# Altium project Liquid Boost.PrjPcb
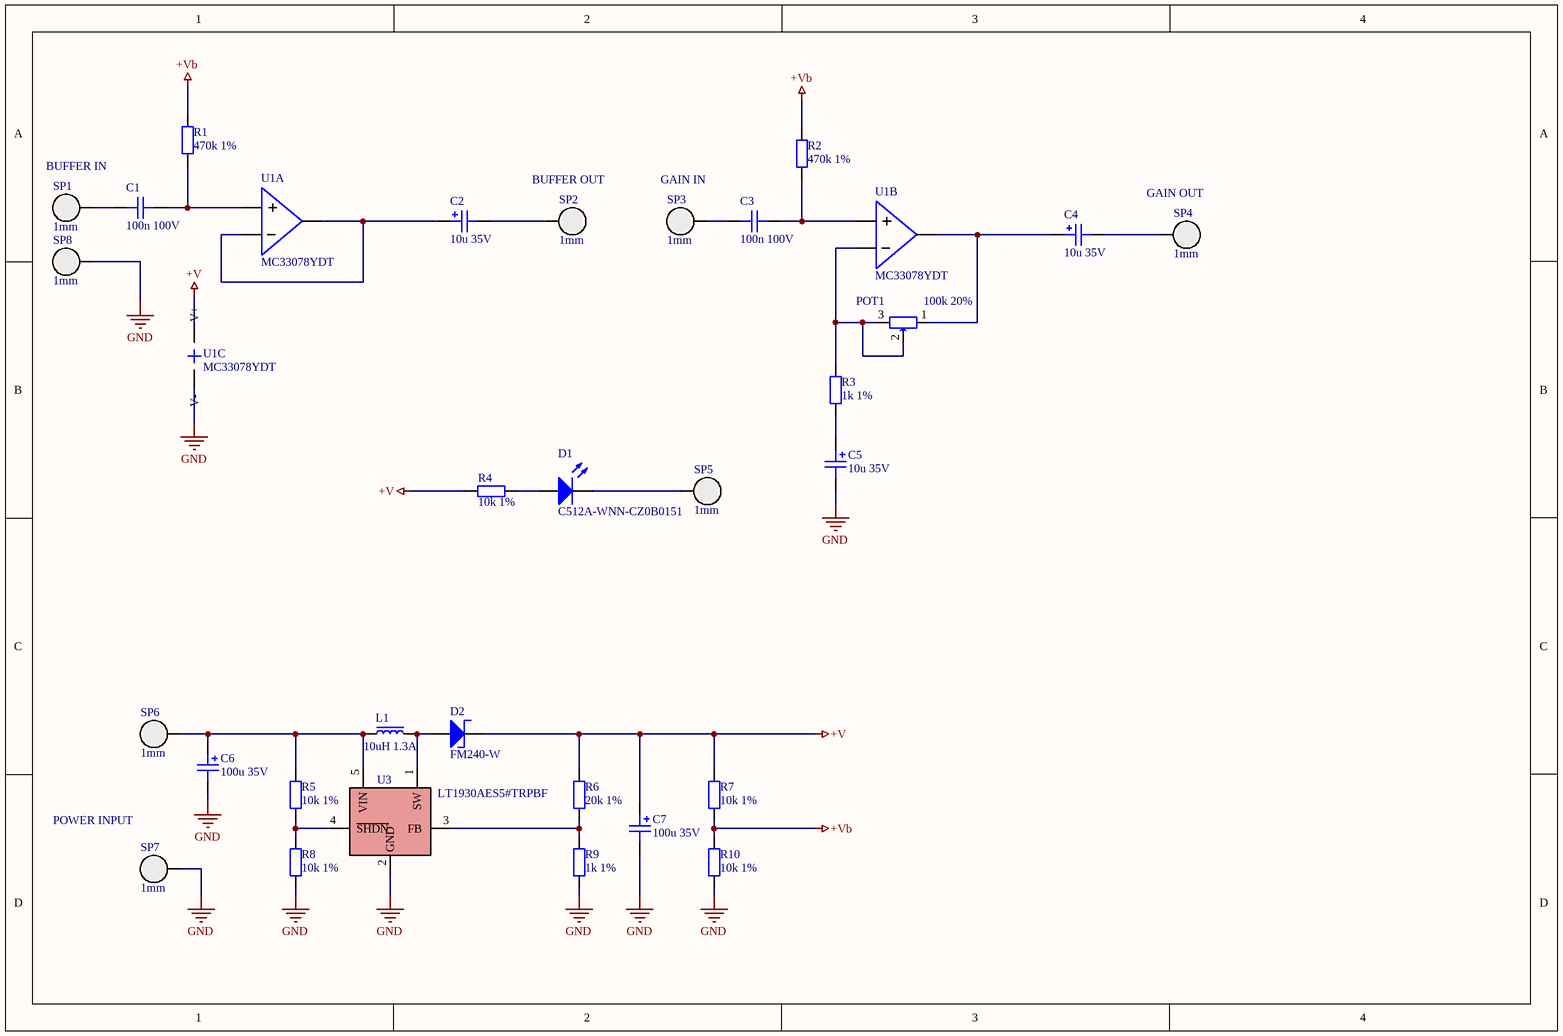
[diagram p0: Liquid Boost.SchDoc]
Series: Liquid; Effect: Booster; Date: 13.10.2021; SCH Designer: Mateusz Kowalczyk; PCB Designer: Mateusz Kowalczyk
1 sheet, 31 parts. Net scope: global (net labels, ports and power ports of the same name join across sheets).
Board file: Liquid Boost.PcbDoc

## Sheet Liquid Boost.SchDoc
size A4

### Parts
C1  100n 100V  [R82EC3100AA70K]
C2  10u 35V  [860010573007]
C3  100n 100V  [R82EC3100AA70K]
C4  10u 35V  [860010573007]
C5  10u 35V  [860010573007]
C6  100u 35V  [860010573007]
C7  100u 35V  [860010573007]
D1  C512A-WNN-CZ0B0151  [C512A-WNN-CZ0B0151]
D2  FM240-W  [FM240-W]
L1  10uH 1.3A  [VLS252012HBX-100M-1]
POT1  100k 20%  [PTV09A]
R1  470k 1%  [Resistor 0603]
R2  470k 1%  [Resistor 0603]
R3  1k 1%  [Resistor 0603]
R4  10k 1%  [Resistor 0603]
R5  10k 1%  [Resistor 0603]
R6  20k 1%  [Resistor 0603]
R7  10k 1%  [Resistor 0603]
R8  10k 1%  [Resistor 0603]
R9  1k 1%  [Resistor 0603]
R10  10k 1%  [Resistor 0603]
SP1  1mm  [SOLDER PAD 1mm]
SP2  1mm  [SOLDER PAD 1mm]
SP3  1mm  [SOLDER PAD 1mm]
SP4  1mm  [SOLDER PAD 1mm]
SP5  1mm  [SOLDER PAD 1mm]
SP6  1mm  [SOLDER PAD 1mm]
SP7  1mm  [SOLDER PAD 1mm]
SP8  1mm  [SOLDER PAD 1mm]
U1  MC33078YDT  [MC33078YDT]  (parts A,B,C of 3)
U3  LT1930AES5#TRPBF  [LT1930AES5#TRPBF]

### Nets
+V: C7.1 D2.2 R4.2 R6.2 R7.2 U1.8(V+)
+Vb: R1.2 R2.2 R7.1 R10.2
GND: C5.2 C6.2 C7.2 R8.1 R9.1 R10.1 SP7.1 SP8.1 U1.4(V-) U3.2(GND)
NetC1_1: C1.1 SP1.1
NetC1_2: C1.2 R1.1 U1.3(IN+)
NetC2_1: C2.1 U1.1(OUT) U1.2(IN-)
NetC2_2: C2.2 SP2.1
NetC3_1: C3.1 SP3.1
NetC3_2: C3.2 R2.1 U1.5(IN+)
NetC4_1: C4.1 POT1.1 U1.7(OUT)
NetC4_2: C4.2 SP4.1
NetC5_1: C5.1 R3.1
NetC6_1: C6.1 L1.1 R5.2 SP6.1 U3.5(VIN)
NetD1_1: D1.1 R4.1
NetD1_2: D1.2 SP5.1
NetD2_1: D2.1 L1.2 U3.1(SW)
NetPOT1_2: POT1.2 POT1.3 R3.2 U1.6(IN-)
NetR5_1: R5.1 R8.2 U3.4(~{SHDN})
NetR6_1: R6.1 R9.2 U3.3(FB)

### Notes on the sheet
- BUFFER IN
- (near SP2) BUFFER OUT
- GAIN IN
- (near SP4) GAIN OUT
- (near SP7) POWER INPUT

### Library data of the parts
C1 C3 = Capacitor 100n 10% 100V R82EC3100AA70K: Film Capacitors 100V 0.1uF 10% LS=5mm AEC-Q200; ComponentLink1Description: Datasheet; ComponentLink1URL: https://pl.mouser.com/datasheet/2/212/1/KEM_F3101_R82-1103738.pdf; Manufacturer Part Number: R82EC3100AA70K
C2 C4 C5 = Capacitor 10u 35V 20% 5mm THT RFS-35V100ME3#5: Aluminum Electrolytic Capacitors - Radial Leaded 10uF 35V 20% Audio SILMIC II; ComponentLink1Description: Datasheet; ComponentLink1URL: https://pl.mouser.com/datasheet/2/129/rfs_e-606.pdf; Manufacturer Part Number: RFS-35V100ME3#5
C6 C7 = Capacitor 100u 35V 20% 6.3mm THT 860010573007: Aluminum Electrolytic Capacitors - Radial Leaded WCAP-ATG8 100uF 35V 20% Radial; ComponentLink1Description: Datasheet; ComponentLink1URL: https://pl.mouser.com/datasheet/2/445/860010573007-1725319.pdf; Manufacturer Part Number: 860010573007
D1 = Diode LED 5mm White THT C512A-WNN-CZ0B0151: Standard LEDs - Through Hole Cool White 4600K 8200-23500mcd; ComponentLink1Description: Datasheet; ComponentLink1URL: https://pl.mouser.com/datasheet/2/723/C512A_WNS_WNN_942-2257872.pdf; Manufacturer Part Number: C512A-WNN-CZ0B0151
D2 = Diode Schottky 2A 40V FM240-W: Schottky Diodes & Rectifiers 2A 40V Schottky; ComponentLink1Description: Datasheet; ComponentLink1URL: https://pl.mouser.com/datasheet/2/345/fm220-fm2200-2949.pdf; Manufacturer Part Number: FM240-W
L1 = Inductor 10uH 1.3A 540mOhms VLS252012HBX-100M-1: Fixed Inductors 10uH 1.3A 540mOhms Power Circuits; ComponentLink1Description: Datasheet; ComponentLink1URL: https://product.tdk.com/system/files/dam/doc/product/inductor/inductor/smd/catalog/inductor_commercial_power_vls252012hbx-1_en.pdf; Manufacturer Part Number: VLS252012HBX-100M-1
POT1 = Potentiometer 100k 20% PTV09A-4015F-B104: Potentiometers 100K 20% 9MM CARBON POT /; ComponentLink1Description: Datasheet; ComponentLink1URL: https://pl.mouser.com/datasheet/2/54/ptv09-777818.pdf; Manufacturer Part Number: PTV09A-4015F-B104
R1 R2 = Resistor 470k 1% RT0603FRE07470KL: Thin Film Resistors - SMD 1/10W 470K ohm 1% 50ppm; ComponentLink1Description: Datasheet; ComponentLink1URL: https://pl.mouser.com/datasheet/2/447/PYu_RT_1_to_0_01_RoHS_L_11-1669912.pdf; Manufacturer Part Number: RT0603FRE07470KL
R3 R9 = Resistor 1k 1% RT0603FRE071KL: Thin Film Resistors - SMD 1K ohm 1% 1/10W; ComponentLink1Description: Datasheet; ComponentLink1URL: https://pl.mouser.com/datasheet/2/447/PYu_RT_1_to_0_01_RoHS_L_11-1669912.pdf; Manufacturer Part Number: RT0603FRE071KL
R4 R5 R7 R8 R10 = Resistor 10k 1% RT0603FRE0710KL: Thin Film Resistors - SMD 1/10W 10K ohm 1% 50ppm; ComponentLink1Description: Datasheet; ComponentLink1URL: https://pl.mouser.com/datasheet/2/447/PYu_RT_1_to_0_01_RoHS_L_11-1669912.pdf; Manufacturer Part Number: RT0603FRE0710KL
R6 = Resistor 20k 1% RT0603FRE0720KL: Thin Film Resistors - SMD 1/10W 20K ohm 1% 50ppm; ComponentLink1Description: Datasheet; ComponentLink1URL: https://pl.mouser.com/datasheet/2/447/PYu_RT_1_to_0_01_RoHS_L_11-1669912.pdf; Manufacturer Part Number: RT0603FRE0720KL
SP1-SP8 = Solder Pad 1mm
U1 = IC OP-AMP MC33078YDT SOP-8: Operational Amplifiers - Op Amps CONDITIONING & INTERFACES; Manufacturer Part Number: MC33078YDT; ComponentLink1Description: Datasheet; ComponentLink1URL: https://pl.mouser.com/datasheet/2/389/cd00000474-1795554.pdf
U3 = IC  Boost Converter LT1930AES5#TRPBF_1: Switching Voltage Regulators 2.2MHz Boost Conv. in 5-lead SOT-23; ComponentLink1Description: Datasheet; ComponentLink1URL: https://pl.mouser.com/datasheet/2/609/1930f-1267314.pdf; Manufacturer Part Number: LT1930AES5#TRPBF